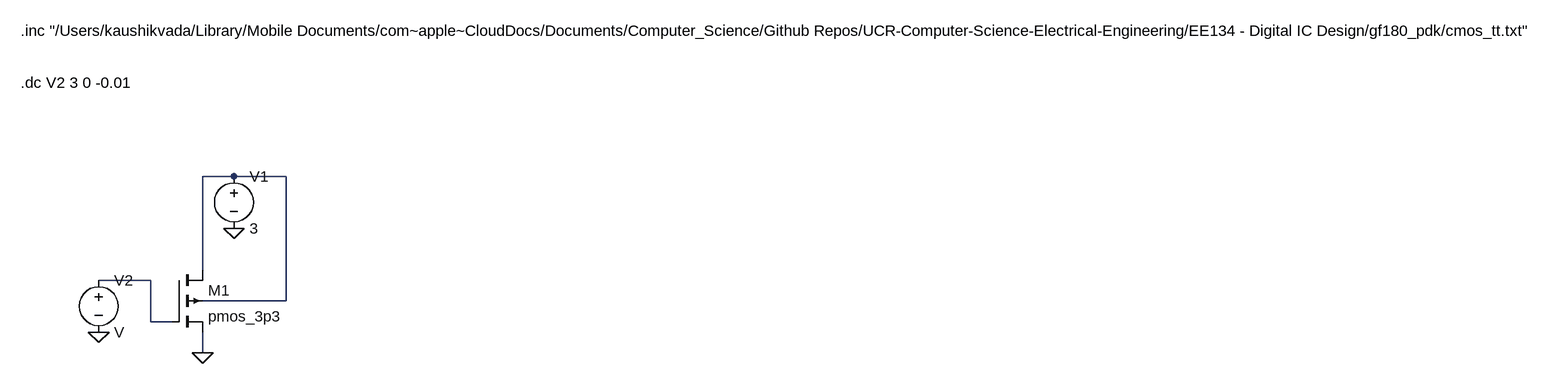
[diagram p0: schematic Draft3.asc]
Draft3.asc, the LTspice schematic file:
Version 4
SHEET 1 2380 680
WIRE 352 96 304 96
WIRE 432 96 352 96
WIRE 304 240 304 96
WIRE 224 256 144 256
WIRE 432 288 432 96
WIRE 432 288 304 288
WIRE 224 320 224 256
WIRE 256 320 224 320
WIRE 304 368 304 336
FLAG 352 176 0
FLAG 144 336 0
FLAG 304 368 0
SYMBOL pmos4 256 240 R0
SYMATTR InstName M1
SYMATTR Value pmos_3p3
SYMATTR Value2 l=1u w=4u
SYMBOL Voltage 352 80 R0
SYMATTR InstName V1
SYMATTR Value 3
SYMBOL Voltage 144 240 R0
SYMATTR InstName V2
TEXT 24 -128 Left 2 !.inc "/Users/kaushikvada/Library/Mobile Documents/com~apple~CloudDocs/Documents/Computer_Science/Github Repos/UCR-Computer-Science-Electrical-Engineering/EE134 - Digital IC Design/gf180_pdk/cmos_tt.txt"
TEXT 24 -48 Left 2 !.dc V2 3 0 -0.01

The netlist it stands for:
* Draft3.asc
M1 N001 N002 0 N001 pmos_3p3 l=1u w=4u
V1 N001 0 3
V2 N002 0 V
.model NMOS NMOS
.model PMOS PMOS
.lib standard.mos
.inc "/Users/kaushikvada/Library/Mobile Documents/com~apple~CloudDocs/Documents/Computer_Science/Github Repos/UCR-Computer-Science-Electrical-Engineering/EE134 - Digital IC Design/gf180_pdk/cmos_tt.txt"
.dc V2 3 0 -0.01
.backanno
.end